# EAGLE design sensor_board_6.1.0 (EAGLE 9.3.2)
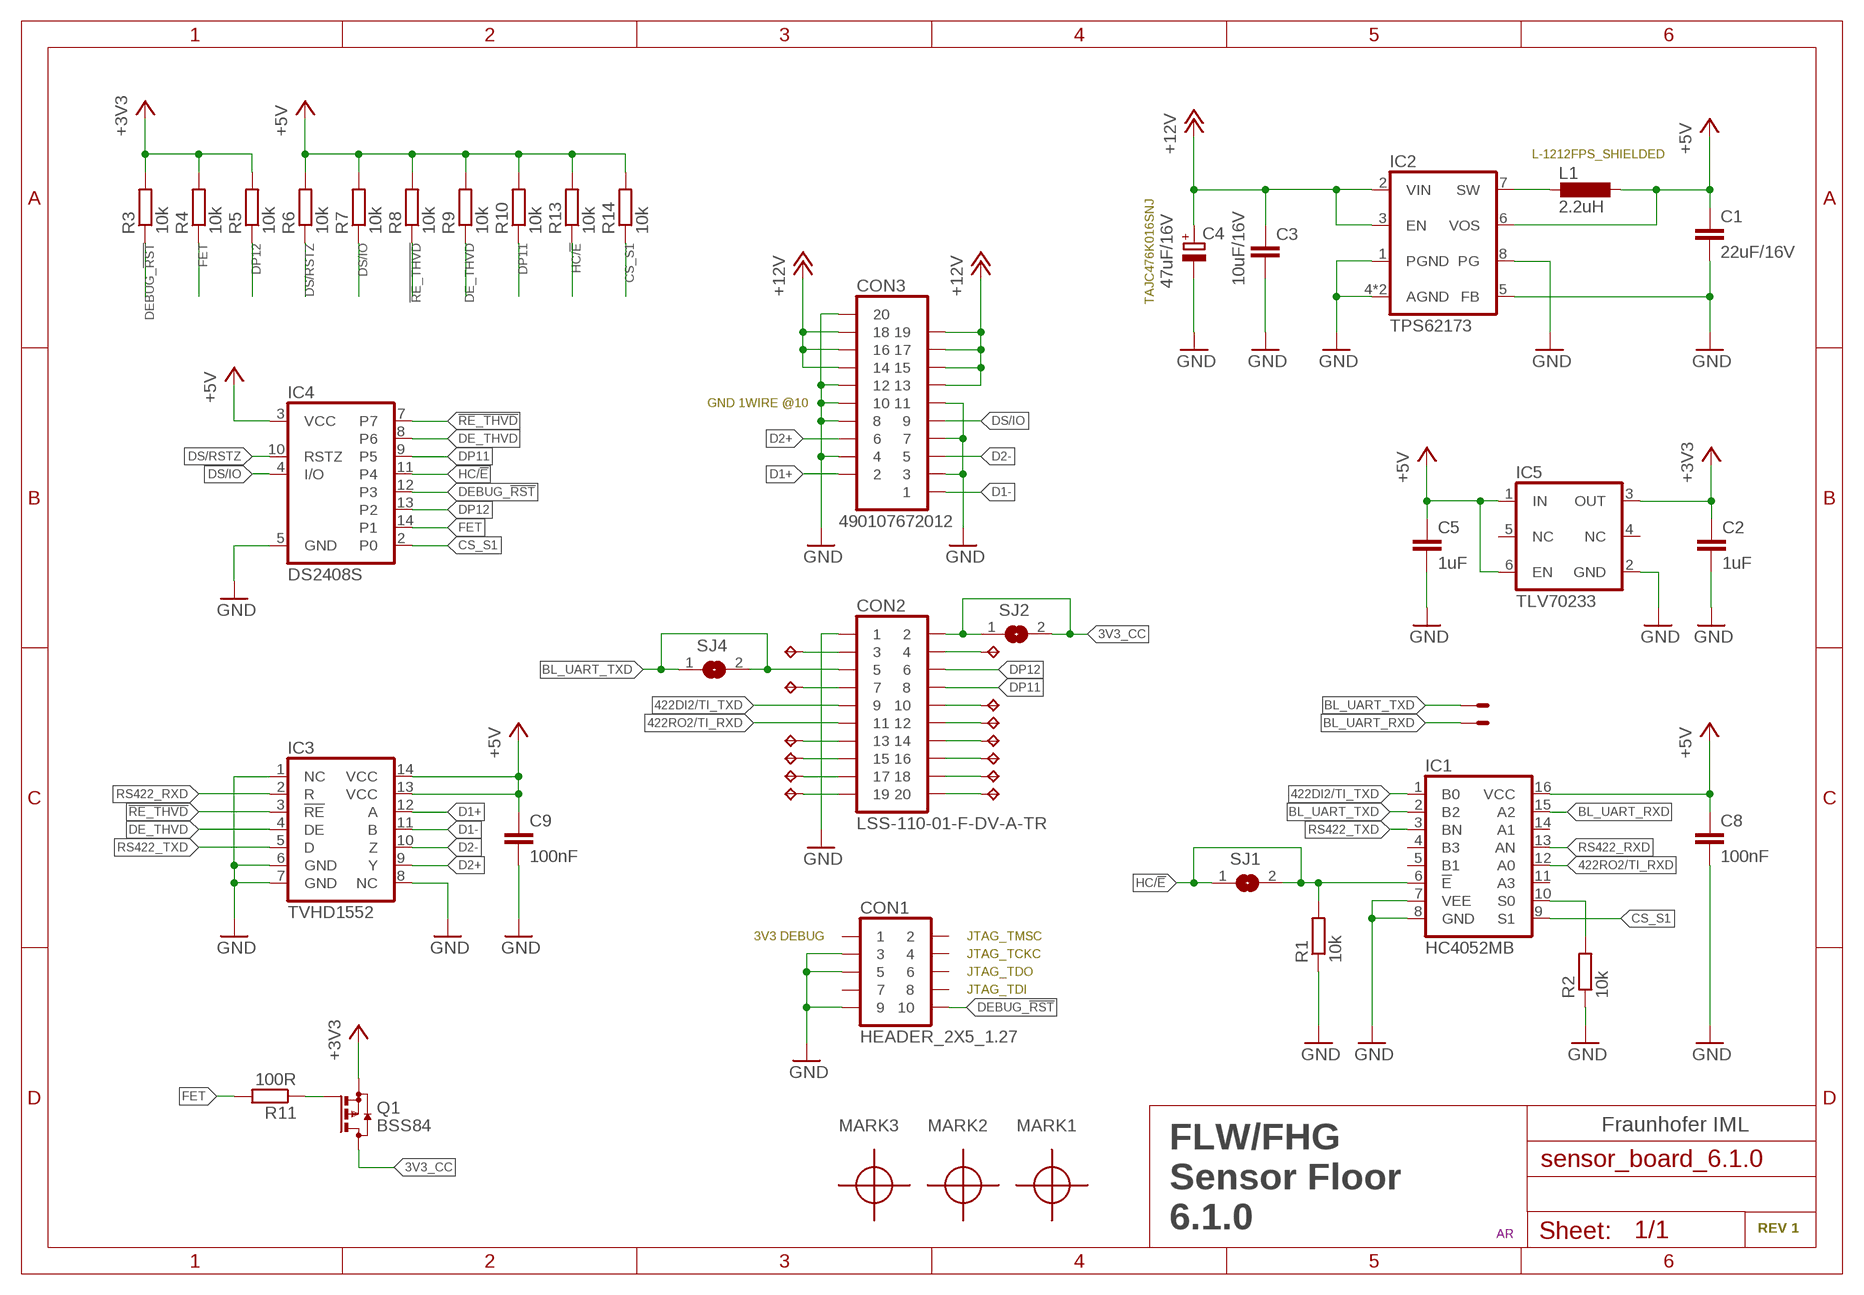
[diagram p0: schematic, sheet 1]

## Parts
C1  22uF/16V  C-EUC0805K  [C0805K]
C2  1uF  C0603  [C0603]
C3  10uF/16V  C-EUC0805K  [C0805K]
C4  47uF/16V  CPOL-EUC/6032-28R  [C/6032-28R]
C5  1uF  C0603  [C0603]
C8  100nF  C0402  [C0402]
C9  100nF  C0402  [C0402]
CON1  HEADER_2X5_1.27  [HEADER_2X5_1.27]
CON2  LSS-110-01-F-DV-A-TR  [LSS-110-01-F-DV-A-TR]
CON3  490107672012  [490107672012]
IC1  HC4052MB  [SO16]
IC2  TPS62173  [WSON8]
IC3  TVHD1552  [SO14]
IC4  DS2408S  [SO16]
IC5  TLV70233  [S-PDSO-N6]
L1  2.2uH  L-1212FPS_SHIELDED  [L-1212FPS_SHIELDED]
MARK1  PASSMARK  [PASSMARK]
MARK2  PASSMARK  [PASSMARK]
MARK3  PASSMARK  [PASSMARK]
Q1  BSS84  [SOT23]
R1  10k  R0402  [R0402]
R2  10k  R0402  [R0402]
R3  10k  R0402  [R0402]
R4  10k  R0402  [R0402]
R5  10k  R0402  [R0402]
R6  10k  R0402  [R0402]
R7  10k  R0402  [R0402]
R8  10k  R0402  [R0402]
R9  10k  R0402  [R0402]
R10  10k  R0402  [R0402]
R11  100R  R0402  [R0402]
R13  10k  R0402  [R0402]
R14  10k  R0402  [R0402]
SJ1  SJT  [SJT]
SJ2  SJT  [SJT]
SJ4  SJT  [SJT]
TP1  TP/SP-1.5X1.0  [SOLDERPAD_1.5X1.0]
TP2  TPTP08R  [TP08R]
TP3  TPTP08R  [TP08R]
TP4  TP/SP-1.5X1.0  [SOLDERPAD_1.5X1.0]
TP5  TPTP08R  [TP08R]
TP6  TPTP08R  [TP08R]
TP7  TPTP08R  [TP08R]
TP8  TPTP08R  [TP08R]
TP9  TPTP08R  [TP08R]
TP10  TPTP08R  [TP08R]
TP11  TPTP08R  [TP08R]
TP12  TPTP08R  [TP08R]
TP13  TPTP08R  [TP08R]
TP14  TPTP08R  [TP08R]
TP15  TPTP08R  [TP08R]

## Nets
3V3_CC: CON2.P2 Q1.3(D) SJ2.1 SJ2.2
422DI2/TI_TXD: CON2.P9 IC1.1(B0)
422RO2/TI_RXD: CON2.P11 IC1.12(A0)
!RE_THVD: IC3.3(!RE) IC4.7 R8.P$1
+3V3: C2.1 IC5.3(OUT) Q1.2(S) R3.P$2 R4.P$2 R5.P$2
+5V: C1.1 C5.1 C8.P$1 C9.P$1 IC1.16(VCC) IC2.6(VOS) IC3.13(VCC) IC3.14(VCC) IC4.3(VCC) IC5.1(IN) IC5.6(EN) L1.1 R6.P$2 R7.P$2 R8.P$2 R9.P$2 R10.P$2 R13.P$2 R14.P$2
+12V: C3.1 C4.+ CON3.13 CON3.14 CON3.15 CON3.16 CON3.17 CON3.18 CON3.19 IC2.2(VIN) IC2.3(EN)
BL_UART_RXD: IC1.15(A2) TP4.1(S)
BL_UART_TXD: CON2.P5 IC1.2(B2) SJ4.1 SJ4.2 TP1.1(S)
CS_S1: IC1.9(S1) IC4.2(P0) R14.P$1
D1+: CON3.2 IC3.12(A)
D1-: CON3.1 IC3.11(B)
D2+: CON3.6 IC3.9(Y)
D2-: CON3.5 IC3.10(Z)
DE_THVD: IC3.4(DE) IC4.8(P6) R9.P$1
DEBUG_!RST: CON1.P$10 IC4.12(P3) R3.P$1
DP11: CON2.P8 IC4.9(P5) R10.P$1
DP12: CON2.P6 IC4.13(P2) R5.P$1
DS/IO: CON3.9 IC4.4(I/O) R7.P$1
DS/RSTZ: IC4.10(RSTZ) R6.P$1
FET: IC4.14(P1) R4.P$1 R11.P$2
GND: C1.2 C2.2 C3.2 C4.- C5.2 C8.P$2 C9.P$2 CON1.P$3 CON1.P$5 CON1.P$9 CON2.P1 CON3.3 CON3.4 CON3.7 CON3.8 CON3.10 CON3.11 CON3.12 CON3.20 IC1.7(VEE) IC1.8(GND) IC2.1(PGND) IC2.4(AGND) IC2.5(FB) IC2.8(PG) IC2.EXP(AGND) IC3.1(NC) IC3.6(GND) IC3.7(GND) IC3.8(NC) IC4.5(GND) IC5.2(GND) R1.P$1 R2.P$1
HC/!E: IC1.6(!E) IC4.11(P4) R1.P$2 R13.P$1 SJ1.1 SJ1.2
N$1: CON2.P10 TP3.TP
N$2: Q1.1(G) R11.P$1
N$3: IC1.10(S0) R2.P$2
N$4: IC2.7(SW) L1.2
N$5: CON2.P12 TP2.TP
N$6: CON2.P14 TP5.TP
N$7: CON2.P16 TP6.TP
N$8: CON2.P18 TP7.TP
N$9: CON2.P20 TP8.TP
N$10: CON2.P19 TP9.TP
N$11: CON2.P17 TP10.TP
N$12: CON2.P15 TP11.TP
N$13: CON2.P13 TP12.TP
N$14: CON2.P7 TP13.TP
N$15: CON2.P4 TP14.TP
N$16: CON2.P3 TP15.TP
RS422_RXD: IC1.13(AN) IC3.2(R)
RS422_TXD: IC1.3(BN) IC3.5(D)
Unconnected: CON1.P$1 CON1.P$2 CON1.P$4 CON1.P$6 CON1.P$7 CON1.P$8 IC1.4(B3) IC1.5(B1) IC1.11(A3) IC1.14(A1) IC5.4(NC) IC5.5(NC)

## Notes on the sheet
- L-1212FPS_SHIELDED
- TAJC476K016SNJ
- GND 1WIRE @10
- 3V3 DEBUG | JTAG_TMSC
- JTAG_TCKC
- JTAG_TDO
- JTAG_TDI
- Fraunhofer IML
- FLW/FHG
  Sensor Floor
  6.1.0
- REV 1
- AR

## Library data of the parts
C1 C3 = rcl:C-EU: CAPACITOR, European symbol
C2 C5 = iml_rcl:C0603
C4 = rcl:CPOL-EU: POLARIZED CAPACITOR, European symbol
C8 C9 = iml_rcl:C0402
CON1 = sensor_floor:HEADER_2X5_1.27
CON2 = sensor_floor:LSS-110-01-F-DV-A-TR
CON3 = sensor_floor:490107672012
IC1 = sensor_floor:HC4052MB
IC2 = sensor_floor:TPS62173
IC3 = sensor_floor:TVHD1552
IC4 = sensor_floor:DS2408
IC5 = iml_elc:TLV702: Low-Dropout Regulator TLV702 300-mA
L1 = sensor_floor:L-1212FPS_SHIELDED
MARK1-MARK3 = iml_elc:PASSMARK
Q1 = transistor-small-signal:BSS84: P-CHANNEL MOS FET
R1-R11 R13 R14 = iml_rcl:R0402
SJ1 SJ2 SJ4 = iml_elc:SJ: SMD solder JUMPER
TP1 TP4 = iml_elc:TP/SP: Solderpads/Testpads
TP2 TP3 TP5-TP15 = testpad:TP: Test pad

## Board
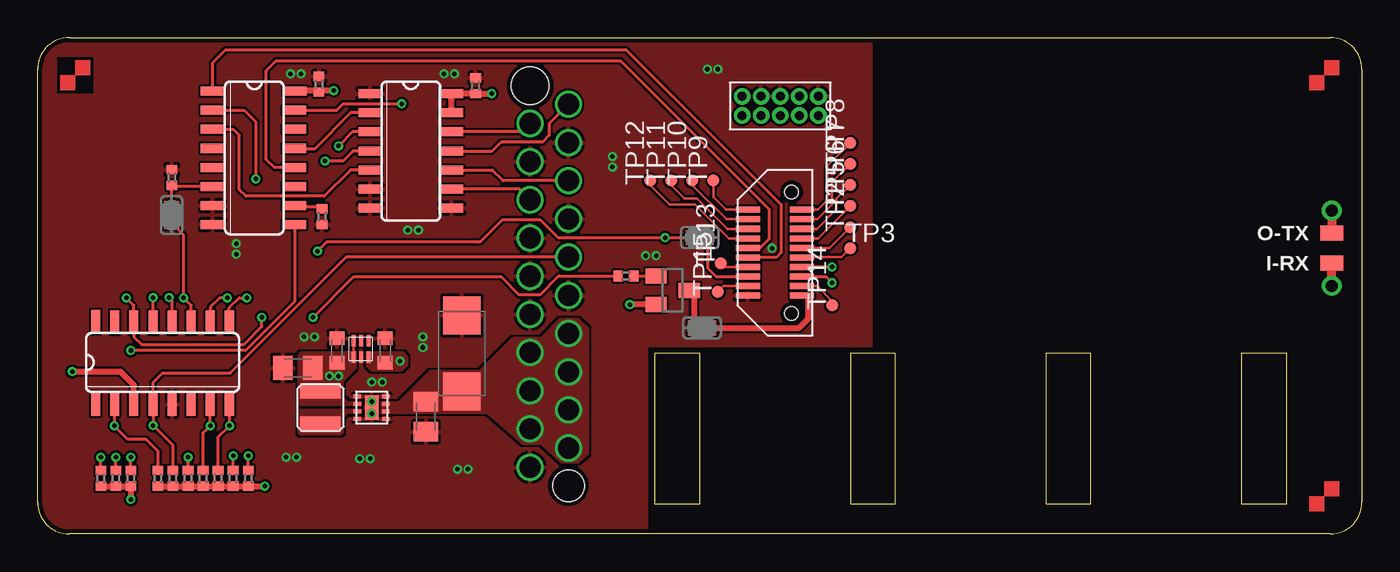
[diagram p1: board, top side]
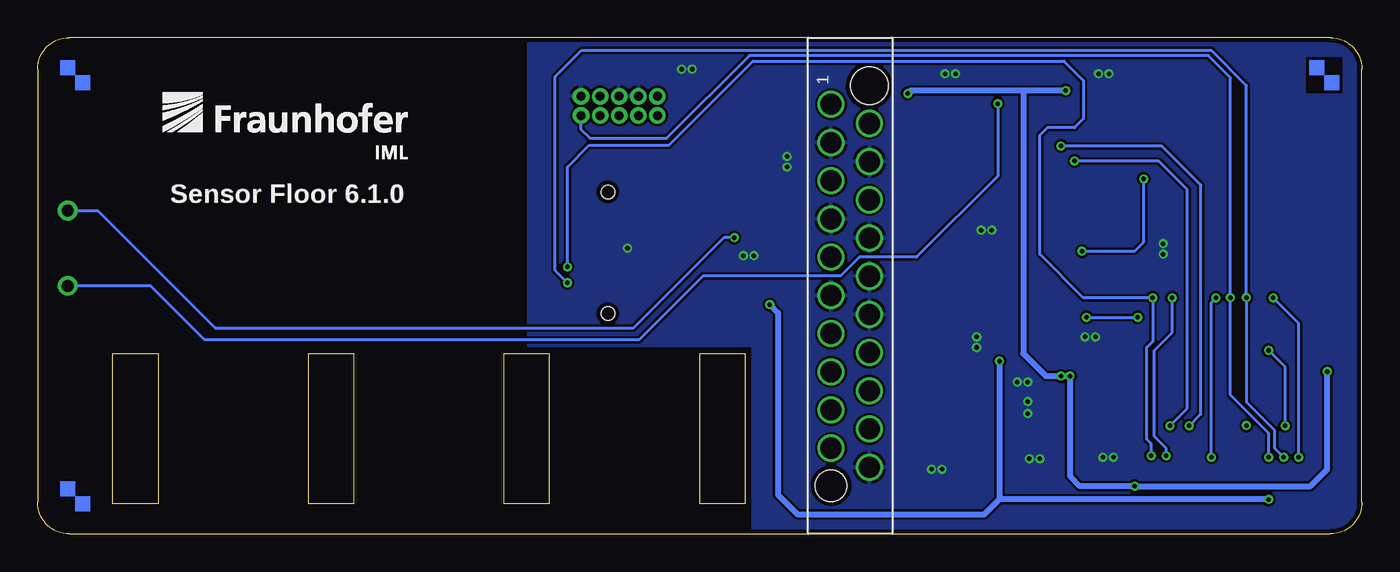
[diagram p2: board, bottom side, seen from below]

Size 88 x 33 mm. Coordinates in mm from the lower left corner, seen from the top.
Outline: 85.9,0 2.1,0 arc-90 0,2.1 0,30.9 arc-90 2.1,33 85.9,33 arc-90 88,30.9 88,2.1 arc-90 85.9,0
Outline: 41,12 41,2 44,2 44,12 41,12
Outline: 80,12 80,2 83,2 83,12 80,12
Outline: 54,12 54,2 57,2 57,12 54,12
Outline: 67,12 67,2 70,2 70,12 67,12
Copper layers (1*16): Top 0.035mm / dielectric 1.5mm / Bottom 0.035mm
Design rules "PCB-POOL Standard": minimum track width 0.15mm, minimum drill 0.3mm, track to track 0.15mm, track to pad 0.15mm, pad to pad 0.15mm, via to via 0.15mm, smd to smd 0.15mm, copper to edge 0.3mm, drill to drill 0.2mm, minimum pad ring 0.2mm, minimum via ring 0.15mm, stop-mask expansion 0.075mm, vias tented up to drill 0mil, thermal gap 0.2mm
tRestrict: area 40.6,0 to 88,12.4; area 55.5,12.4 to 88,33; area 1.3,29.3 to 3.7,31.7
bRestrict: area 40.6,0 to 88,12.4; area 55.5,12.4 to 88,33; area 1.3,29.3 to 3.7,31.7

### Footprints (pad centres in the part's own frame; a part is rotated, then mirrored left to right if it is on the bottom)
C0805K = smd 1.3 x 1.6: 1 -1,0; 2 1,0
C0603 = smd 0.9 x 1: 1 -0.8,0; 2 0.8,0
C/6032-28R = smd 2.55 x 2.5: + 2.525,0; - -2.525,0
C0402 = smd 0.61 x 0.711: P$1 -0.52,0; P$2 0.52,0
HEADER_2X5_1.27 = drill 0.6 pad 1.1: P$1 -2.54,0.635; P$2 -2.54,-0.635; P$3 -1.27,0.635; P$4 -1.27,-0.635; P$5 0,0.635; P$6 0,-0.635; P$7 1.27,0.635; P$8 1.27,-0.635; P$9 2.54,0.635; P$10 2.54,-0.635
LSS-110-01-F-DV-A-TR = smd 0.4 x 1.6: P1 2.857,-1.8; P2 2.857,1.8; P3 2.223,-1.8; P4 2.223,1.8; P5 1.587,-1.8; P6 1.587,1.8; P7 0.953,-1.8; P8 0.953,1.8; P9 0.318,-1.8; P10 0.318,1.8; P11 -0.318,-1.8; P12 -0.318,1.8; P13 -0.953,-1.8; P14 -0.953,1.8; P15 -1.587,-1.8; P16 -1.587,1.8; P17 -2.223,-1.8; P18 -2.223,1.8; P19 -2.857,-1.8; P20 -2.857,1.8 | hole 0.89: 4.04,1.1; -4.04,1.1
490107672012 = drill 1.4 pad 1.42: 1 12.065,1.27; 2 10.795,-1.27; 3 9.525,1.27; 4 8.255,-1.27; 5 6.985,1.27; 6 5.715,-1.27; 7 4.445,1.27; 8 3.175,-1.27; 9 1.905,1.27; 10 0.635,-1.27; 11 -0.635,1.27; 12 -1.905,-1.27; 13 -3.175,1.27; 14 -4.445,-1.27; 15 -5.715,1.27; 16 -6.985,-1.27; 17 -8.255,1.27; 18 -9.525,-1.27; 19 -10.795,1.27; 20 -12.065,-1.27 | hole 2.1: -13.295,1.27 | hole 2.5: 13.295,-1.27
SO16 = smd 0.6 x 1.55: 1 -4.445,-2.773; 2 -3.175,-2.773; 3 -1.905,-2.773; 4 -0.635,-2.773; 5 0.635,-2.773; 6 1.905,-2.773; 7 3.175,-2.773; 8 4.445,-2.773; 9 4.445,2.673; 10 3.175,2.673; 11 1.905,2.673; 12 0.635,2.673; 13 -0.635,2.673; 14 -1.905,2.673; 15 -3.175,2.673; 16 -4.445,2.7
WSON8 = smd 0.5 x 0.25: 1 -0.95,0.75; 2 -0.95,0.25; 3 -0.95,-0.25; 4 -0.95,-0.75; 5 0.95,-0.75; 6 0.95,-0.25; 7 0.95,0.25; 8 0.95,0.75 | smd 0.9 x 1.6: EXP 0,0
SO14 = smd 0.6 x 1.55: 1 -3.175,-2.7; 2 -1.905,-2.7; 3 -0.635,-2.7; 4 0.635,-2.7; 5 1.905,-2.7; 6 3.175,-2.7; 7 4.445,-2.7; 8 4.445,2.7; 9 3.175,2.7; 10 1.905,2.7; 11 0.635,2.7; 12 -0.635,2.7; 13 -1.905,2.7; 14 -3.175,2.7
S-PDSO-N6 = smd 0.28 x 0.75: 1 -0.5,-0.55; 2 0,-0.55; 3 0.5,-0.55; 4 0.5,0.55; 5 0,0.55; 6 -0.5,0.55
L-1212FPS_SHIELDED = smd 1 x 2.7: 1 1.1,0; 2 -1.1,0
SOT23 = smd 1 x 1.4: 1 -0.95,-1.1; 2 0.95,-1.1; 3 0,1.1
R0402 = smd 0.61 x 0.711: P$1 -0.52,0; P$2 0.52,0
SJT = smd 0.8 x 1: 1 -0.524,0; 2 0.524,0
SOLDERPAD_1.5X1.0 = smd 1 x 1.5: 1 0,0
TP08R = smd 0.8 x 0.8: TP 0,0

### Placement (x,y rotation side)
C1  17.3,11.05 180 top
C2  23.1,12.2 90 top
C3  25.8,7.8 270 top
C4  28.2,12 270 top
C5  19.9,12.2 90 top
C8  18.7,29.9 90 top
C9  29.1,29.8 90 top
CON1  49.35,28.46 0 top
CON2  49,18.7 270 top
CON3  34,16.5 90 bottom
IC1  14.4,25 270 top
IC2  22.2,8.4 180 top
IC3  24.8,26.1 270 top
IC4  8.3,11.4 0 top
IC5  21.5,12.3 0 top
L1  18.8,8.4 90 top
MARK1  2.5,30.5 0 top
MARK2  85.5,30.5 0 top
MARK3  85.5,2.5 0 top
Q1  42.2,16.2 270 top
R1  8.93,23.7 270 top
R2  18.9,21.1 90 top
R3  6.2,3.7 270 top
R4  4.2,3.7 270 top
R5  5.2,3.7 270 top
R6  13,3.7 270 top
R7  9,3.7 270 top
R8  11,3.7 270 top
R9  12,3.7 270 top
R10  14,3.7 270 top
R11  39.1,17.15 180 top
R13  10,3.7 270 top
R14  8,3.7 270 top
SJ1  8.9,21.2 90 top
SJ2  44.15,13.7 0 top
SJ4  44,19.7 180 top
TP1  86,20 90 top
TP2  54,20.4 90 top
TP3  54,19 0 top
TP4  86,18 90 top
TP5  54,21.8 90 top
TP6  54,23.2 90 top
TP7  54,24.6 90 top
TP8  54,26 90 top
TP9  44.9,23.5 90 top
TP10  43.5,23.5 90 top
TP11  42.1,23.5 90 top
TP12  40.7,23.5 90 top
TP13  45.4,18 90 top
TP14  52.8,15.2 90 top
TP15  45.2,16.1 90 top
U$2  [IML_0.13_TPLACE]  79.8,24.8 0 bottom

### Tracks (layer width: path | path; a pad name or v marks a point on that pad's centre or on a via)
3V3_CC
  Top 0.15: SJ2.1 SJ2.2
  Top 0.254: CON2.P2 51.16,15.84 51.2,15.8
  Top 0.406: Q1.3 43.63,15.87 SJ2.1 | SJ2.2 50.6,13.7 51.2,14.3 51.2,15.8
422DI2/TI_TXD
  Top 0.2: IC1.1 11.63,31.33 12.5,32.2 39.1,32.2 49.4,21.9 49.4,18.7 49.08,18.38 CON2.P9
422RO2/TI_RXD
  Top 0.2: IC1.12 15.73,24.36 15.2,24.9 15.2,30.8 15.85,31.45 38.75,31.45 48.6,21.6 48.6,19.6 48.02,19.02 CON2.P11
!RE_THVD  (via drill 0.3 pad 0.6)
  Top 0.2: IC3.3 20.93,26.73 v20,25.8 | IC4.7 v11.47,7.2 11,6.72 R8.P$1
  Bottom 0.2: v20,25.8 13.3,25.8 10.7,23.2 10.7,7.97 v11.47,7.2
+3V3  (via drill 0.3 pad 0.6)
  Top 0.406: Q1.2 v39.35,15.25 | R4.P$2 R5.P$2 R3.P$2 v6.2,2.3
  Bottom 0.406: 24.1,2.3 25.1,1.3 37.5,1.3 38.8,2.6 38.8,14.7 v39.35,15.25 | v6.2,2.3 24.1,2.3 | 24.1,2.3 24.07,2.33 v24.07,11.5
  pour Top (no thermals): 21.85,12.12 24.27,12.12 24.6,11.8 24.6,11.2 24.2,10.8 22.2,10.8 21.85,11.15
+5V  (via drill 0.3 pad 0.6)
  Top 0.15: IC5.1 IC5.6
  Top 0.406: IC3.13 27.48,28.02 27.48,29.2 27.5,29.22 IC3.14 C9.P$1 v30.18,29.28 | IC4.3 6.39,9.9 5.5,10.8 v2.3,10.8 | R14.P$2 R7.P$2 R13.P$2 R8.P$2 R9.P$2 R6.P$2 R10.P$2 v15.1,3.18 v15.1,3.17 | v19.68,29.48 18.8,29.48 | 18.8,29.48 17.14,29.48 IC1.16 | C8.P$1 18.8,29.48
  Bottom 0.2: 19.39,5.8 19.39,5.3 19.4,5.3
  Bottom 0.406: 30.2,29.26 v30.18,29.28 29.98,29.48 22.5,29.48 | v19.68,29.48 22.5,29.48 | v2.3,10.8 2.3,4.3 3.42,3.17 v15.1,3.17 18.73,3.17 19.4,3.85 19.4,5.3 v19.4,10.5 v20,10.5 21,10.5 22.5,12 22.5,29.48
  pour Top (no thermals): 21.5,8.8 21.5,8.5 17.5,8.5 17.3,8.7 17.3,11.9 17.52,12.12 21.15,12.12 21.15,11 20.3,10.15 20.3,9.1 20.6,8.8
+12V
  pour Top (no thermals): 22.82,8.82 24.02,8.82 26.1,10.9 29.4,10.9 31.6,13.1 33.5,13.1 34.7,14.38 35.9,14.38 36.6,13.7 36.6,5.3 35.9,4.7 34.8,4.7 33.48,5.92 32.27,5.92 29.9,7.97 22.82,7.97
BL_UART_RXD  (via drill 0.3, 0.8 pad 1.3)
  Top 0.2: IC1.15 19.88,28.18 20.3,28.6 v24.2,28.6
  Top 0.61: v86,16.5 TP4.1
  Bottom 0.2: v24.2,28.6 24.2,23.8 29.6,18.4 33.4,18.4 34.65,17.15 43.77,17.15 48.02,12.9 76.9,12.9 80.5,16.5 v86,16.5
BL_UART_TXD  (via drill 0.3, 0.8 pad 1.3)
  Top 0: SJ4.2 43.7,19.7 | SJ4.1 44.3,19.7
  Top 0.15: 44.3,19.7 43.7,19.7
  Top 0.2: CON2.P5 45.09,17.11 44.52,17.68 SJ4.1 | v18.6,18.8 19.2,19.4 29.4,19.4 30.9,20.9 33.4,20.9 34.6,19.7 v41.7,19.7 SJ4.2 | v14.5,23.6 14.5,27.4 13.72,28.18 IC1.2
  Top 0.61: v86,21.5 TP1.1
  Bottom 0.2: v18.6,18.8 15.1,18.8 14.5,19.4 v14.5,23.6 | v41.7,19.7 42.4,19.7 48.4,13.7 76.2,13.7 84,21.5 v86,21.5
CS_S1  (via drill 0.3 pad 0.6)
  Top 0.2: IC1.9 17.07,15.46 13.81,12.2 v6.2,12.2 | IC4.2 5.1,8.6 v5.1,7.2 6,6.3 7.2,6.3 8,5.5 R14.P$1
  Bottom 0.2: v5.1,7.2 5.1,11.1 v6.2,12.2
D1+
  Top 0.15: 28,26.73 IC3.12
  Top 0.2: CON3.2 32.17,26.73 IC3.12
D1-
  Top 0.15: 27.95,25.46 IC3.11
  Top 0.2: CON3.1 34,27.3 34,26.5 33.55,26.05 30.8,26.05 30.21,25.46 IC3.11
D2+
  Top 0.15: 27.9,22.8 28,22.9 27.98,22.93 IC3.9
  Top 0.2: CON3.6 32.02,22.93 IC3.9
D2-
  Top 0.15: 28.05,24.2 IC3.10
  Top 0.2: CON3.5 30.91,23.48 30.2,24.2 IC3.10
DE_THVD  (via drill 0.3 pad 0.6)
  Top 0.2: IC3.4 20.96,25.46 20.3,24.8 v19.1,24.8 | IC4.8 v12.75,7.2 12,6.45 R9.P$1
  Bottom 0.2: v19.1,24.8 13.5,24.8 11.6,22.9 11.6,8.35 v12.75,7.2
DEBUG_!RST  (via drill 0.3 pad 0.6)
  Top 0.2: 8.73,14.27 IC4.12 8.94,15.52 v8.73,15.71 | R3.P$1 v6.2,5.1
  Bottom 0.2: CON1.P$10 51.89,26.89 51.3,26.3 46.2,26.3 40.7,31.8 10.2,31.8 8.73,30.34 v8.73,15.71 8.73,9.23 6.2,6.7 v6.2,5.1
DP11  (via drill 0.3 pad 0.6)
  Top 0.2: IC4.9 12.74,15.04 13.4,15.7 v13.9,15.7 | R10.P$1 v14,5.2 | v52.8,17.75 CON2.P8
  Bottom 0.2: v52.8,17.75 52.8,24.4 51.35,25.85 46.05,25.85 40.46,31.45 19.8,31.45 18.5,30.14 18.5,27.6 19.1,27 20.9,27 21.4,26.5 21.4,18.6 18.5,15.7 v13.9,15.7 13.9,12.8 14.3,12.4 14.3,6.3 14,6 v14,5.2
DP12  (via drill 0.3 pad 0.6)
  Top 0.2: CON2.P6 52.39,17.11 v52.8,16.7 | IC4.13 v7.67,15.71 | R5.P$1 v5.2,5.1
  Bottom 0.2: v52.8,16.7 53.6,17.5 53.6,30.4 51.85,32.15 10,32.15 7.67,29.82 v7.67,15.71 7.67,8.77 5.8,6.9 5.8,5.7 v5.2,5.1
DS/IO  (via drill 0.3 pad 0.6)
  Top 0.2: R7.P$1 9,5.88 v7.67,7.21 IC4.4 7.67,10.06 8.3,10.7 12.8,10.7 20.51,18.41 CON3.9
DS/RSTZ  (via drill 0.3 pad 0.6)
  Top 0.2: v12.6,15.7 12.1,15.7 11.47,15.07 IC4.10 | R6.P$1 v13,5.2
  Bottom 0.2: v13,5.2 13,5.7 13.8,6.5 13.8,12.2 12.6,13.4 v12.6,15.7
FET  (via drill 0.3 pad 0.6)
  Top 0.2: v5.9,15.7 6.39,15.21 IC4.14 6.39,13.11 6.9,12.6 13.71,12.6 14.9,13.79 v14.9,14.4 | R4.P$1 v4.2,5.1 | R11.P$2 34.62,17.15 33.38,15.9 32.01,15.9 30.8,17.11 21,17.11 v18.3,14.4
  Bottom 0.2: v18.3,14.4 v14.9,14.4 | v4.2,5.1 4.2,14 v5.9,15.7
GND  (via drill 0.3 pad 0.6)
  other vias: 48.8,19 18.4,13.1 17.7,13.1 27.7,30.6 27,30.6 16.8,30.6 17.5,30.6 25.6,13.1 25.6,12.4 22.2,8.8 22.2,8 22.2,10.1 22.9,10.1 40.4,18.5 41.1,18.5 28.6,4.3 27.9,4.3 44.5,30.9 45.2,30.9 24.6,20.2 25.3,20.2 38.2,25.1 38.2,24.4 13.2,19.3 13.2,18.6 21.4,5 22.1,5 16.5,5.1 17.2,5.1
  pour Top (rank 2): 0,33 88,33 88,0 0,0
  pour Bottom (rank 2): 0,33 88,33 88,0 0,0
HC/!E  (via drill 0.3 pad 0.6)
  Top 0: SJ1.1 8.9,20.8 | SJ1.2 8.9,21.6
  Top 0.15: 8.9,21.6 8.9,20.8
  Top 0.2: IC4.11 10.21,15.2 v9.7,15.7 9.7,19.88 SJ1.1 | R13.P$1 v10,5.1 | 8.8,21.82 SJ1.2 8.9,23.16 R1.P$2 9.01,23.09 IC1.6
  Bottom 0.2: v10,5.1 10,15.4 v9.7,15.7
N$1
  Top 0.15: TP3.TP 53.4,18.4 51.1,18.4 50.82,18.4 CON2.P10
N$2
  Top 0.2: R11.P$1 Q1.1
N$3
  Top 0.2: IC1.10 17.18,21.72 18.8,21.72 R2.P$2
N$4
  pour Top (no thermals): 21.5,8.3 21.5,8 20.6,8 20.3,7.7 20.3,6.7 20.15,6.55 17.45,6.55 17.3,6.7 17.3,8.1 17.5,8.3
N$5
  Top 0.15: TP2.TP 52.62,19.02 CON2.P12
N$6
  Top 0.15: CON2.P14 51.85,19.65 TP5.TP
N$7
  Top 0.15: CON2.P16 51.79,20.29 53.1,21.6 53.1,22.3 TP6.TP
N$8
  Top 0.15: CON2.P18 51.82,20.92 52.8,21.9 52.8,23.4 TP7.TP
N$9
  Top 0.15: CON2.P20 51.86,21.56 52.5,22.2 52.5,24.5 TP8.TP
N$10
  Top 0.15: CON2.P19 45.74,21.56 44.9,22.4 TP9.TP
N$11
  Top 0.15: CON2.P17 45.78,20.92 43.5,23.2 TP10.TP
N$12
  Top 0.15: TP11.TP 42.1,23.2 43,22.3 43.82,22.3 45.84,20.29 CON2.P15
N$13
  Top 0.15: CON2.P13 45.95,19.65 43.7,21.9 42,21.9 40.7,23.2 TP12.TP
N$14
  Top 0.15: CON2.P7 45.65,17.75 TP13.TP
N$15
  Top 0.15: CON2.P4 51.82,16.48 52.8,15.5 TP14.TP
N$16
  Top 0.15: CON2.P3 45.58,16.48 TP15.TP
RS422_RXD
  Top 0.2: IC3.2 20.8,28 18.4,25.6 17.11,25.6 IC1.13
RS422_TXD
  Top 0.2: IC3.5 20.8,24.2 19.05,22.45 13.85,22.45 13.4,22.9 13.4,26.5 12.99,26.91 IC1.3

### Text on the board
tPlace: O-TX | I-RX
bPlace: Sensor Floor 6.1.0